# EAGLE design Rev-2 PCB (EAGLE 9.2.1)
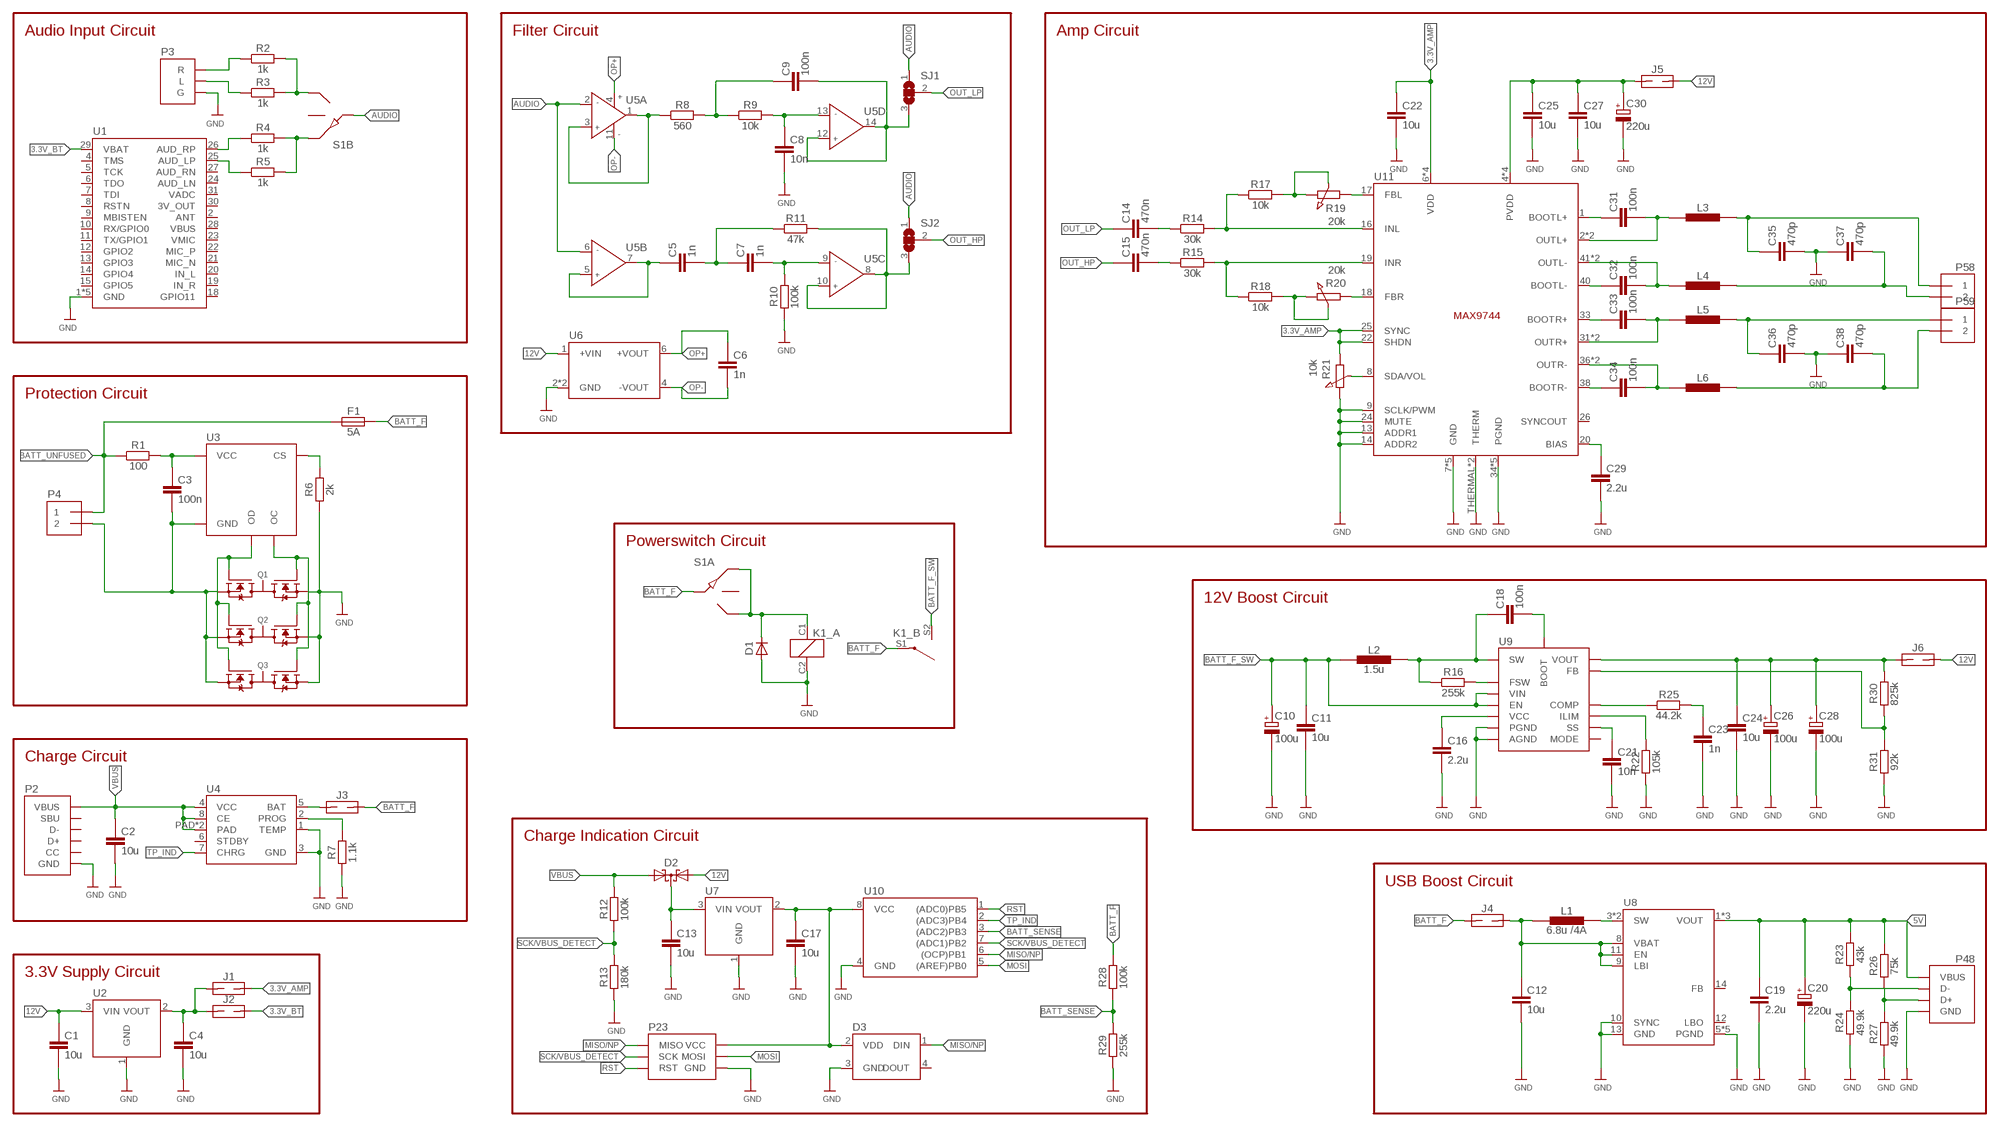
[diagram p0: schematic, sheet 1]

## Parts
C1  10u  CAPACITOR  [R0603]
C2  10u  CAPACITOR1206  [1206]
C3  100n  CAPACITOR  [R0603]
C4  10u  CAPACITOR  [R0603]
C5  1n  CAPACITOR  [R0603]
C6  1n  CAPACITOR  [R0603]
C7  1n  CAPACITOR  [R0603]
C8  10n  CAPACITOR  [R0603]
C9  100n  CAPACITOR  [R0603]
C10  100u  CAPACITOR_POL6.3X7.7MM  [UD-6,3X7,7_NICHICON]
C11  10u  CAPACITOR1206  [1206]
C12  10u  CAPACITOR1206  [1206]
C13  10u  CAPACITOR  [R0603]
C14  470n  CAPACITOR  [R0603]
C15  470n  CAPACITOR  [R0603]
C16  2.2u  CAPACITOR  [R0603]
C17  10u  CAPACITOR  [R0603]
C18  100n  CAPACITOR  [R0603]
C19  2.2u  CAPACITOR  [R0603]
C20  220u  CAPACITOR_POL6.3X7.7MM  [UD-6,3X7,7_NICHICON]
C21  10n  CAPACITOR  [R0603]
C22  10u  CAPACITOR1206  [1206]
C23  1n  CAPACITOR  [R0603]
C24  10u  CAPACITOR1206  [1206]
C25  10u  CAPACITOR1206  [1206]
C26  100u  CAPACITOR_POL6.3X7.7MM  [UD-6,3X7,7_NICHICON]
C27  10u  CAPACITOR1206  [1206]
C28  100u  CAPACITOR_POL6.3X7.7MM  [UD-6,3X7,7_NICHICON]
C29  2.2u  CAPACITOR  [R0603]
C30  220u  CAPACITOR_POL6.3X7.7MM  [UD-6,3X7,7_NICHICON]
C31  100n  CAPACITOR0805  [0805]
C32  100n  CAPACITOR0805  [0805]
C33  100n  CAPACITOR0805  [0805]
C34  100n  CAPACITOR0805  [0805]
C35  470p  CAPACITOR0805  [0805]
C36  470p  CAPACITOR0805  [0805]
C37  470p  CAPACITOR0805  [0805]
C38  470p  CAPACITOR0805  [0805]
D1  DIODEDO-214AC  [DO214AC]
D2  BAS70-05  [SOT23]
D3  NEOPIXEL  [LED-RGB-THRU]
F1  5A  FUSESMD  [FUSE_SMD]
J1  JUMPER_2S  [SJ]
J2  JUMPER_2S  [SJ]
J3  JUMPER_2S  [SJ]
J4  JUMPER_2S  [SJ]
J5  JUMPER_2S  [SJ]
J6  JUMPER_2S  [SJ]
K1  RELAY_2  [RELAY]
L1  6.8u /4A  INDUCTOR6516  [INDUCTOR234545]
L2  1.5u  INDUCTOR6519  [INDUCTOR2345]
L3  INDUCTOR0805  [0805]
L4  INDUCTOR0805  [0805]
L5  INDUCTOR0805  [0805]
L6  INDUCTOR0805  [0805]
P2  USB_TYPE-C  [TYPE-C]
P3  AUX  [AUDIO]
P4  HEADER_2MOLEX  [MOLEX_43650_2P]
P23  SPI-HEADERNS  [2X3-NS]
P48  USB_TYPE-A  [USB-A]
P58  HEADER_2MOLEX  [MOLEX_43650_2P]
P59  HEADER_2MOLEX  [MOLEX_43650_2P]
Q1  FS8205  [SOP65P640X120-8N]
Q2  FS8205  [SOP65P640X120-8N]
Q3  FS8205  [SOP65P640X120-8N]
R1  100  RESISTOR0603  [R0603]
R2  1k  RESISTOR0603  [R0603]
R3  1k  RESISTOR0603  [R0603]
R4  1k  RESISTOR0603  [R0603]
R5  1k  RESISTOR0603  [R0603]
R6  2k  RESISTOR0603  [R0603]
R7  1.1k  RESISTOR0603  [R0603]
R8  560  RESISTOR0603  [R0603]
R9  10k  RESISTOR0603  [R0603]
R10  100k  RESISTOR0603  [R0603]
R11  47k  RESISTOR0603  [R0603]
R12  100k  RESISTOR0603  [R0603]
R13  180k  RESISTOR0603  [R0603]
R14  30k  RESISTOR0603  [R0603]
R15  30k  RESISTOR0603  [R0603]
R16  255k  RESISTOR0603  [R0603]
R17  10k  RESISTOR0603  [R0603]
R18  10k  RESISTOR0603  [R0603]
R19  20k  POTLARGE  [TRIMMPOTI]
R20  20k  POTLARGE  [TRIMMPOTI]
R21  10k  POT  [POT]
R22  105k  RESISTOR0603  [R0603]
R23  43k  RESISTOR0603  [R0603]
R24  49.9k  RESISTOR0603  [R0603]
R25  44.2k  RESISTOR0603  [R0603]
R26  75k  RESISTOR0603  [R0603]
R27  49.9k  RESISTOR0603  [R0603]
R28  100k  RESISTOR0603  [R0603]
R29  255k  RESISTOR0603  [R0603]
R30  825k  RESISTOR0603  [R0603]
R31  92k  RESISTOR0603  [R0603]
S1  SWITCH  [FE06]
SJ1  SJ2W  [SJ_2]
SJ2  SJ2W  [SJ_2]
U1  BK8000  [WIRELESS-BLUETOOTH-BK8000]
U2  REG1118SOT23-3  [SOT23]
U3  FS312F  [TSOT23-6]
U4  TP4056  [SOP-8]
U5  QUAD_OP  [SO14]
U6  NMA  [CONV_PCN2-S24-D15-S]
U7  REG1118SOT23-3  [SOT23]
U8  TPS6103X  [PVQFN-16]
U9  TPS61088  [QFN50P450X350X100-21N]
U10  TINY15LS  [SOIC8]
U11  MAX9744  [TQFN44_7MM]

## Nets
3.3V_AMP: C22.1 J1.2 R21.1 U11.6(VDD) U11.10(VDD) U11.21(VDD) U11.22(SHDN) U11.25(SYNC) U11.28(VDD)
3.3V_BT: J2.2 U1.29(VBAT)
5V: C19.1 C20.+ P48.VBUS R23.2 R26.2 U8.1(VOUT) U8.15(VOUT) U8.16(VOUT)
12V: C1.1 D2.1(A1) J5.2 J6.2 U2.3(VIN) U6.1(+VIN)
12V_AMP: C25.1 C27.1 C30.+ J5.1 U11.4(PVDD) U11.5(PVDD) U11.29(PVDD) U11.30(PVDD)
AUDIO: S1.P$6(B:C) SJ1.1 SJ2.1 U5.2(A:IN-) U5.6(B:IN-)
BATT_F: F1.2 J3.2 J4.1 K1.S1(_B:MITTE) R28.2 S1.P$5(A:C)
BATT_F_SW: C10.+ C11.1 K1.S2(_B:OFF) L2.P$1 U9.2(EN) U9.9(VIN)
BATT_SENSE: R28.1 R29.2 U10.3((ADC2)PB3)
BATT_UNFUSED: F1.1 P4.1 R1.1
GND: C1.2 C2.2 C4.2 C8.2 C10.- C11.2 C12.2 C13.2 C16.2 C17.2 C19.2 C20.- C21.2 C22.2 C23.2 C24.2 C25.2 C26.- C27.2 C28.- C29.2 C30.- C35.2 C36.2 C37.1 C38.1 D1.A D3.3(GND) K1.C2 P2.A1/B12(GND) P2.B1/A12(GND) P2.P$1(GND) P2.P$2(GND) P2.P$3(GND) P2.P$4(GND) P2.P$5(GND) P2.P$6(GND) P2.P$7(GND) P2.P$8(GND) P2.P$9(GND) P2.P$10(GND) P2.P$11(GND) P2.P$12(GND) P2.P$13(GND) P2.P$14(GND) P2.P$15(GND) P2.P$16(GND) P2.P$17(GND) P2.P$18(GND) P2.P$19(GND) P2.P$20(GND) P2.P$21(GND) P2.P$22(GND) P2.P$23(GND) P2.P$24(GND) P2.P$25(GND) P2.P$26(GND) P2.P$27(GND) P2.P$28(GND) P2.P$29(GND) P2.P$30(GND) P2.P$31(GND) P2.P$32(GND) P2.P$33(GND) P2.P$34(GND) P2.P$35(GND) P2.P$36(GND) P2.P$37(GND) P2.P$38(GND) P3.P$3(G) P23.6(GND) P48.GND P48.S1(GND) P48.S2(GND) P48.S3(GND) P48.S4(GND) Q1.6(S2) Q1.7(S2) Q2.6(S2) Q2.7(S2) Q3.6(S2) Q3.7(S2) R6.1 R7.1 R10.1 R13.1 R21.3 R22.1 R24.1 R27.1 R29.1 R31.1 U1.1(GND) U1.3(GND) U1.16(GND) U1.17(GND) U1.32(GND) U2.1(GND) U4.1(TEMP) U4.3(GND) U6.2(GND) U6.5(GND) U7.1(GND) U8.5(PGND) U8.6(PGND) U8.7(PGND) U8.10(SYNC) U8.13(GND) U8.THERMAL1(PGND) U8.THERMAL(PGND) U9.20(AGND) U9.21(PGND) U9.22(PGND) U9.23(PGND) U10.4(GND) U11.7(GND) U11.9(SCLK/PWM) U11.11(GND) U11.12(GND) U11.13(ADDR1) U11.14(ADDR2) U11.15(GND) U11.24(MUTE) U11.27(GND) U11.34(PGND) U11.35(PGND) U11.39(PGND) U11.43(PGND) U11.44(PGND) U11.THERMAL1(THERM) U11.THERMAL(THERM)
MISO/NP: D3.1(DIN) P23.1(MISO) U10.6((OCP)PB1)
MOSI: P23.4(MOSI) U10.5((AREF)PB0)
N$1: C3.2 P4.2 Q1.2(S1) Q1.3(S1) Q2.2(S1) Q2.3(S1) Q3.2(S1) Q3.3(S1) U3.6(GND)
N$2: C3.1 R1.2 U3.5(VCC)
N$3: R6.2 U3.2(CS)
N$4: R8.1 U5.1(A:OUT) U5.3(A:IN+)
N$5: Q1.4(G1) Q2.4(G1) Q3.4(G1) U3.1(OD)
N$6: C13.1 D2.3(C) U7.3(VIN)
N$7: Q1.5(G2) Q2.5(G2) Q3.5(G2) U3.3(OC)
N$8: R16.2 U9.3(FSW)
N$9: C16.1 U9.1(VCC)
N$10: C18.2 U9.8(BOOT)
N$11: C18.1 L2.P$2 R16.1 U9.4(SW) U9.5(SW) U9.6(SW) U9.7(SW)
N$12: R22.2 U9.19(ILIM)
N$13: R7.2 U4.2(PROG)
N$14: C21.1 U9.10(SS)
N$15: R25.1 U9.18(COMP)
N$16: C23.1 R25.2
N$17: L1.P$2 U8.3(SW) U8.4(SW)
N$18: R30.1 R31.2 U9.17(FB)
N$19: C4.1 J1.1 J2.1 U2.2(VOUT)
N$20: C17.1 D3.2(VDD) P23.2(VCC) U7.2(VOUT) U10.8(VCC)
N$21: P48.D+ R26.1 R27.2
N$22: P48.D- R23.1 R24.2
N$23: C12.1 J4.2 L1.P$1 U8.8(VBAT) U8.9(LBI) U8.11(EN)
N$24: R21.2 U11.8(SDA/VOL)
N$25: J3.1 U4.5(BAT)
N$26: C9.1 R8.2 R9.1
N$27: C5.1 U5.5(B:IN+) U5.7(B:OUT)
N$28: R4.1 U1.26(AUD_RP)
N$29: R5.1 U1.25(AUD_LP)
N$30: C8.1 R9.2 U5.13(D:IN-)
N$31: C5.2 C7.1 R11.1
N$32: C7.2 R10.2 U5.9(C:IN-)
N$33: C24.1 C26.+ C28.+ J6.1 R30.2 U9.14(VOUT) U9.15(VOUT) U9.16(VOUT)
N$34: R18.2 R20.2 R20.3
N$35: R17.2 R19.2 R19.3
N$36: P3.P$1(L) R3.1
N$37: R19.1 U11.17(FBL)
N$38: D1.C K1.C1 S1.P$1 S1.P$3
N$39: R4.2 R5.2 S1.P$8
N$40: R2.2 R3.2 S1.P$10
N$41: P3.P$2(R) R2.1
N$42: R20.1 U11.18(FBR)
N$45: R14.2 R17.1 U11.16(INL)
N$46: R15.2 R18.1 U11.19(INR)
N$47: C29.1 U11.20(BIAS)
N$48: C31.1 U11.1(BOOTL+)
N$49: C31.2 L3.1 U11.2(OUTL+) U11.3(OUTL+)
N$50: C14.2 R14.1
N$51: C15.2 R15.1
N$52: C32.1 U11.40(BOOTL-)
N$53: C32.2 L4.1 U11.41(OUTL-) U11.42(OUTL-)
N$54: C33.1 U11.33(BOOTR+)
N$55: C33.2 L5.1 U11.31(OUTR+) U11.32(OUTR+)
N$56: C34.1 U11.38(BOOTR-)
N$57: C34.2 L6.1 U11.36(OUTR-) U11.37(OUTR-)
N$58: C35.1 L3.2 P58.1
N$59: C37.2 L4.2 P58.2
N$60: C36.1 L5.2 P59.1
N$61: C38.2 L6.2 P59.2
OP+: C6.1 U5.4(A:+) U6.6(+VOUT)
OP-: C6.2 U5.11(A:-) U6.4(-VOUT)
OUT_HP: C15.1 SJ2.2
OUT_HP_OP: R11.2 SJ2.3 U5.8(C:OUT) U5.10(C:IN+)
OUT_LP: C14.1 SJ1.2
OUT_LP_OP: C9.2 SJ1.3 U5.12(D:IN+) U5.14(D:OUT)
RST: P23.5(RST) U10.1((ADC0)PB5)
SCK/VBUS_DETECT: P23.3(SCK) R12.1 R13.2 U10.7((ADC1)PB2)
TP_IND: U4.7(CHRG) U10.2((ADC3)PB4)
VBUS: C2.1 D2.2(A2) P2.A4/B9(VBUS) P2.B4/A9(VBUS) R12.2 U4.4(VCC) U4.8(CE) U4.PAD U4.PAD2(PAD)
Unconnected: D3.4(DOUT) P2.A5(CC) P2.A6(D+) P2.A7(D-) P2.A8(SBU) P2.B5(CC) P2.B6(D+) P2.B7(D-) P2.B8(SBU) Q1.1(D12) Q1.8(D12) Q2.1(D12) Q2.8(D12) Q3.1(D12) Q3.8(D12) S1.P$2 S1.P$9 U1.2(ANT) U1.4(TMS) U1.5(TCK) U1.6(TDO) U1.7(TDI) U1.8(RSTN) U1.9(MBISTEN) U1.10(RX/GPIO0) U1.11(TX/GPIO1) U1.12(GPIO2) U1.13(GPIO3) U1.14(GPIO4) U1.15(GPIO5) U1.18(GPIO11) U1.19(IN_R) U1.20(IN_L) U1.21(MIC_N) U1.22(MIC_P) U1.23(VMIC) U1.24(AUD_LN) U1.27(AUD_RN) U1.28(VBUS) U4.6(STDBY) U8.12(LBO) U8.14(FB) U9.13(MODE) U11.26(SYNCOUT)

## Notes on the sheet
- Audio Input Circuit | Filter Circuit | Amp Circuit
- Protection Circuit
- Powerswitch Circuit
- 12V Boost Circuit
- Charge Circuit
- Charge Indication Circuit
- USB Boost Circuit
- 3.3V Supply Circuit

## Power pins joined to a net without a drawn wire
3V_OUT: U1.30(3V_OUT)
VADC: U1.31(VADC)

## Library data of the parts
C1 C4-C9 C13 C17 C22 C25 C27 C29 C31-C38 = 0_Library-Rev2:CAPACITOR; SPICEPREFIX: C
C2 C3 C11 C12 C14-C16 C18 C19 C21 C23 C24 = 0_Library-Rev2:CAPACITOR
C10 C20 C26 C28 C30 = 0_Library-Rev2:CAPACITOR_POL
D1 = 0_Library-Rev2:DIODE: DIODE General purpose 1N400x type rectifier (With bigger pads) http://www.ladyada.net/library/pcb/eaglelibrary.html
D2 = 0_Library-Rev2:BAS70-05: Silicon Schottky Diodes General-purpose diode for high-speed switching
D3 = 0_Library-Rev2:NEOPIXEL
F1 = 0_Library-Rev2:FUSE
J1-J6 = 0_Library-Rev2:JUMPER_2
K1 = 0_Library-Rev2:RELAY_2
L1-L6 = 0_Library-Rev2:INDUCTOR
P2 = 0_Library-Rev2:USB_TYPE-C
P3 = 0_Library-Rev2:AUX; SPICEPREFIX: J
P4 P58 P59 = 0_Library-Rev2:HEADER_2
P23 = 0_Library-Rev2:SPI-HEADER: AVR ISP 6 Pin This is the reduced ISP connector for AVR programming. Common on Arduino. This footprint will take up less PCB space and can be used with a 10-pin to 6-pin adapter such as SKU: BOB-08508 **Special note about "TEST_POINT" package. The stop mask is on the top side, so if you want your programming test points to be on the bottom of your board, make sure to place this package on the bottom side of the board. This also ensure that the orientation to program from the bottom side will be correct. SparkFun Products: SparkFun ISP Pogo Adapter <https://www.sparkfun.com/products/11591> - NS Tiny AVR Programmer <https://www.sparkfun.com/products/11801> -PTH; SPICEPREFIX: X
P48 = 0_Library-Rev2:USB_TYPE-A
Q1-Q3 = 0_Library-Rev2:FS8205
R1 R6 R7 R12-R18 R22-R31 = 0_Library-Rev2:RESISTOR
R2-R5 R8-R11 = 0_Library-Rev2:RESISTOR; SPICEPREFIX: R
R19-R21 = 0_Library-Rev2:POT
S1 = 0_Library-Rev2:SWITCH; SPICEPREFIX: S
SJ1 SJ2 = jumper:SJ2W: SMD solder JUMPER
U1 = 0_Library-Rev2:BK8000; SPICEPREFIX: X
U2 = 0_Library-Rev2:REG1118: 800mA Low Dropout (LDO) Positive Regulator with Current Source and Sink Capability; SPICEPREFIX: U
U3 = 0_Library-Rev2:FS312F
U4 = 0_Library-Rev2:TP4056
U5 = 0_Library-Rev2:QUAD_OP; SPICEPREFIX: X
U6 = 0_Library-Rev2:NMA; SPICEPREFIX: E
U7 = 0_Library-Rev2:REG1118: 800mA Low Dropout (LDO) Positive Regulator with Current Source and Sink Capability
U8 = 0_Library-Rev2:TPS6103X: TPS6103x 4A Boost - 1.8-5.5V Input, Adjustable Output to 5.5V
U9 = 0_Library-Rev2:TPS61088
U10 = 0_Library-Rev2:TINY15L: MICROCONTROLLER 2.7 V 1 Kbytes FLASH 64 bytes EEPROM 4-channel 10 bit ADC; OC_FARNELL: unknown; OC_NEWARK: unknown
U11 = 0_Library-Rev2:MAX9744

## Board
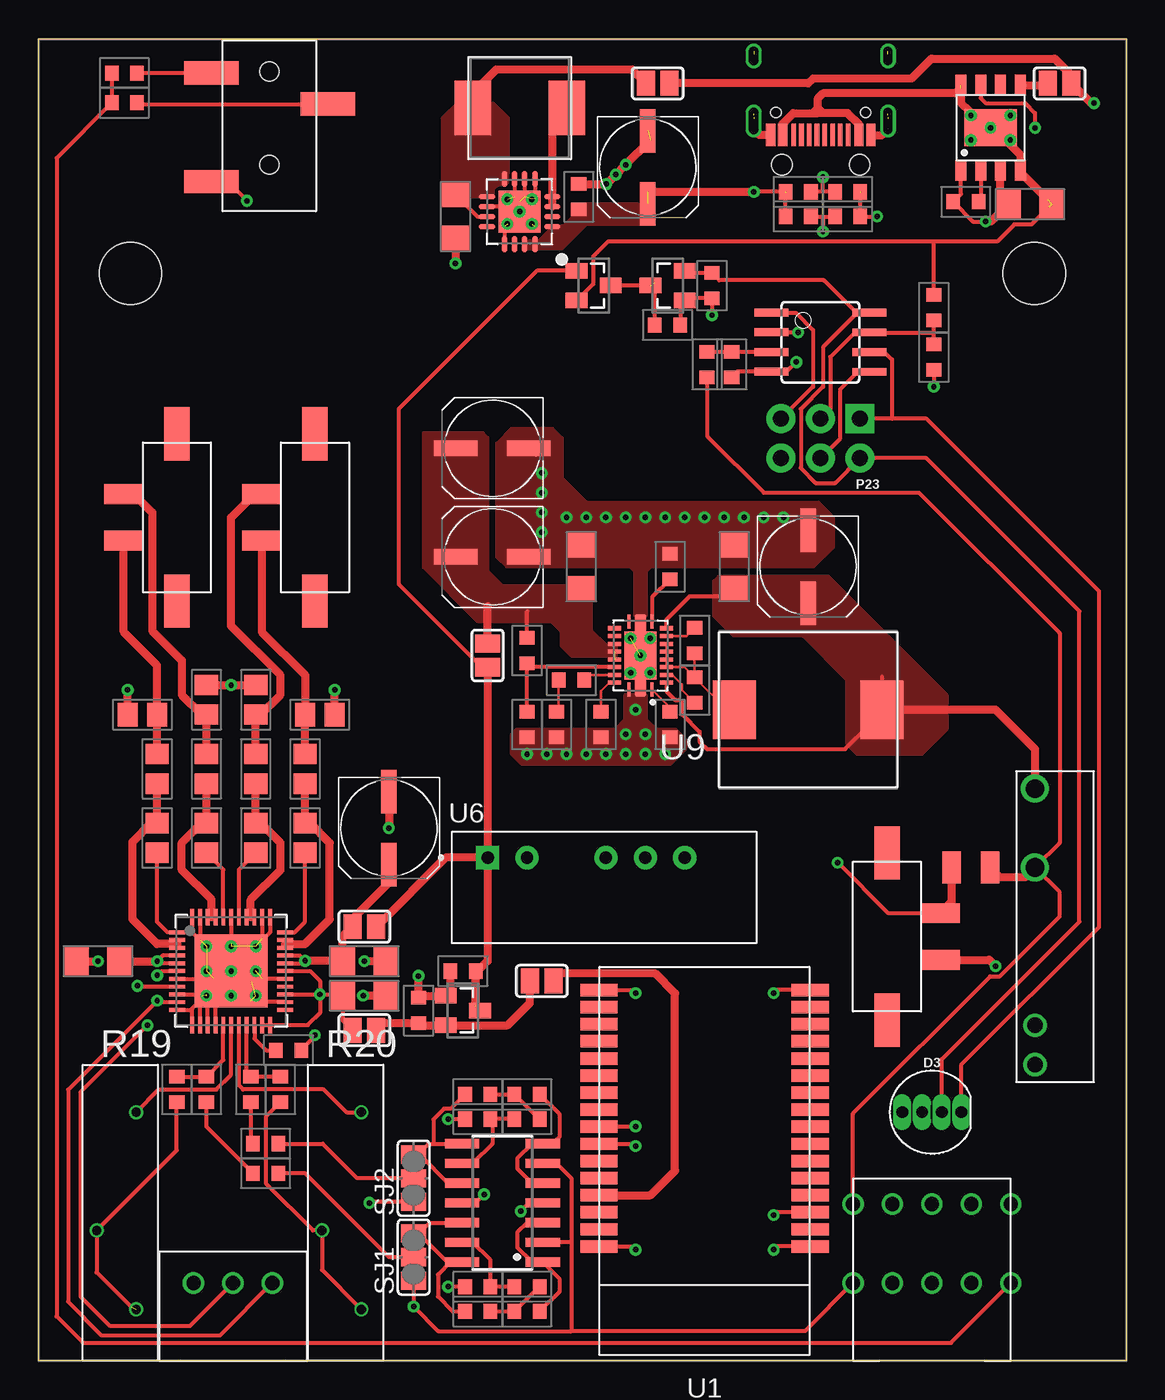
[diagram p1: board, top side]
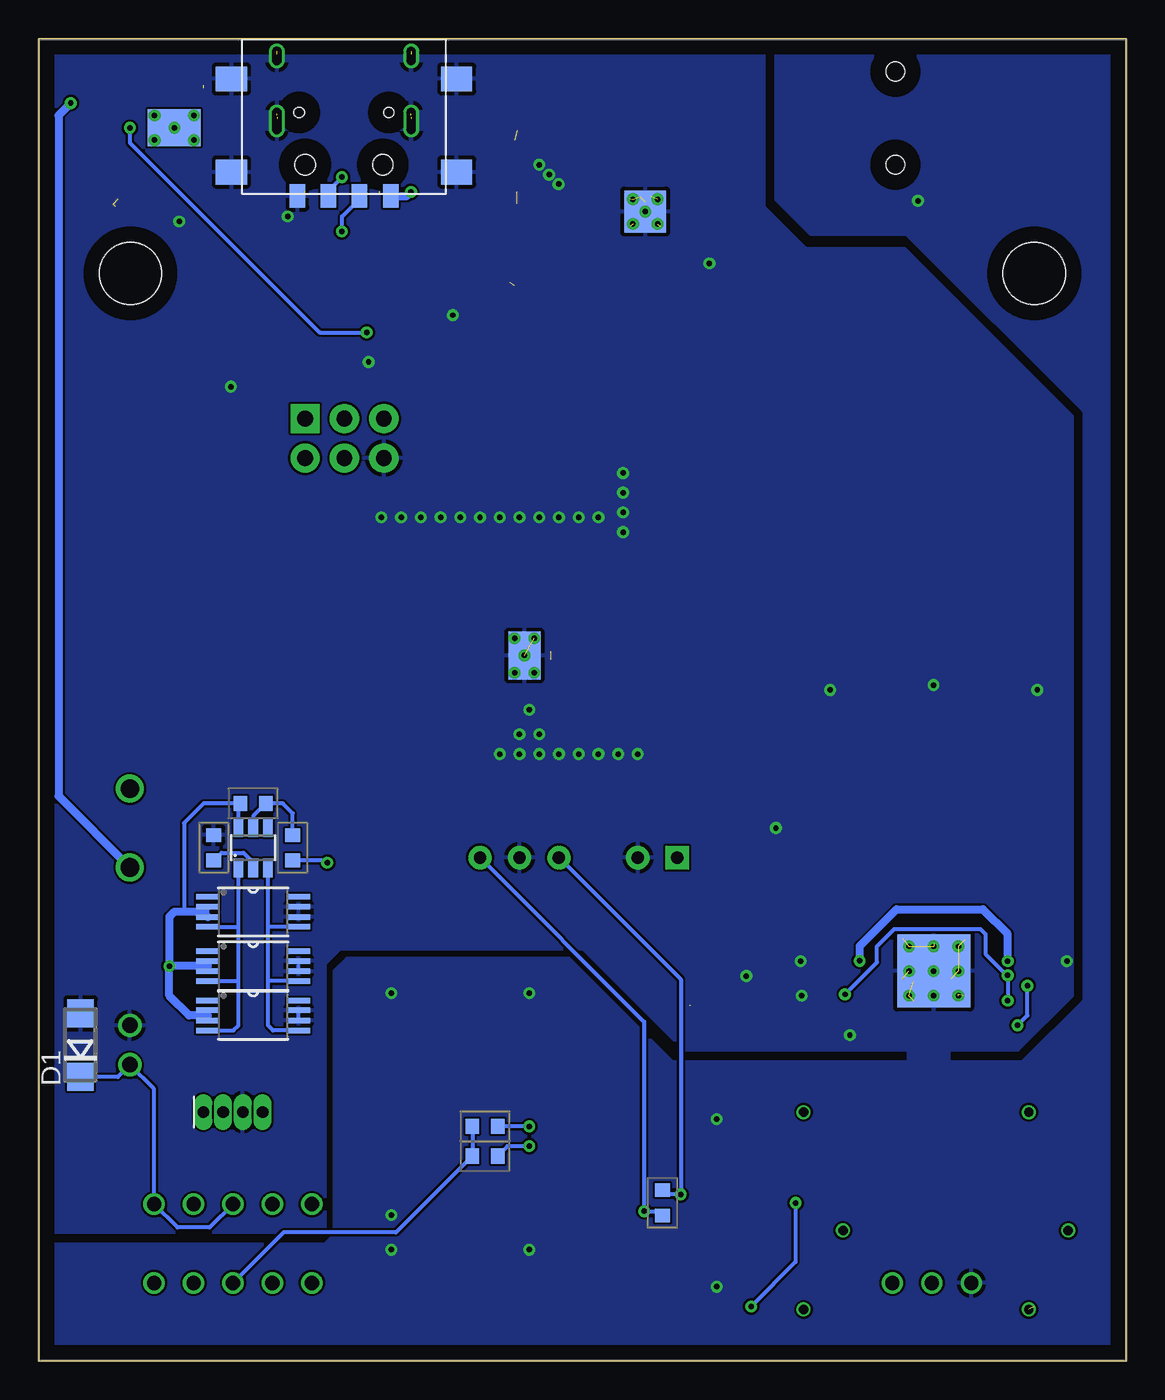
[diagram p2: board, bottom side, seen from below]

Size 70 x 85.1 mm. Coordinates in mm from the lower left corner, seen from the top.
Outline: 0,0 0,85.1 70,85.1 70,0 0,0
Copper layers (1*16): Top 0.035mm / dielectric 1.5mm / Bottom 0.035mm
Design rules "default *": minimum track width 6mil, minimum drill 0.35mm, track to track 6mil, track to pad 6mil, pad to pad 6mil, via to via 6mil, smd to smd 6mil, copper to edge 40mil, drill to drill 6mil, minimum pad ring 0mil, minimum via ring 8mil, stop-mask expansion 4mil, vias tented up to drill 0mil, thermal gap 10mil
Holes 4 mm at 5.9,70 64.1,70

### Footprints (pad centres in the part's own frame; a part is rotated, then mirrored left to right if it is on the bottom)
R0603 = smd 0.87 x 0.98: 1 -0.815,0; 2 0.815,0
1206 = smd 1.6 x 1.8: 1 -1.4,0; 2 1.4,0
UD-6,3X7,7_NICHICON = smd 2.8 x 1: + 2.35,0; - -2.35,0
0805 = smd 1.3 x 1.5: 1 -0.95,0; 2 0.95,0
DO214AC = smd 1.8 x 1.7: A 2.05,0; C -2.05,0
SOT23 = smd 1 x 1.4: 1 -0.95,-1.1; 2 0.95,-1.1; 3 0,1.1
LED-RGB-THRU = drill 0.762 pad 0.889 long: 1 1.905,0; 2 0.635,0; 3 -0.635,0; 4 -1.905,0
FUSE_SMD = smd 1.185 x 2.05: 1 -1.232,0; 2 1.232,0
SJ = smd 1.168 x 1.6: 1 -0.762,0; 2 0.762,0
RELAY = drill 1: C1 0,0; C2 2.54,0 | drill 1.2: S1 12.7,0; S2 17.78,0
INDUCTOR234545 = smd 2.35 x 3.5: P$1 -3.025,0; P$2 3.025,0
INDUCTOR2345 = smd 2.75 x 3.75: P$1 -4.75,0; P$2 4.75,0
TYPE-C = smd 0.6 x 1.45: A1/B12 -3.225,7.695; A4/B9 -2.45,7.695; B1/A12 3.225,7.695; B4/A9 2.45,7.695 | smd 0.3 x 1.45: A5 -1.25,7.695; A6 -0.25,7.695; A7 0.25,7.695; A8 1.25,7.695; B5 1.75,7.695; B6 0.75,7.695; B7 -0.75,7.695; B8 -1.75,7.695 | drill 0.6 pad 1: P$1 -4.32,6.23; P$2 -4.32,6.53; P$3 -4.32,6.63; P$4 -4.32,6.73; P$5 -4.32,6.33; P$6 -4.32,7.23; P$7 4.32,6.83; P$8 4.32,6.23; P$9 4.32,6.53; P$10 4.32,6.63; P$11 -4.32,7.13; P$12 -4.32,6.43; P$13 -4.32,6.83; P$14 4.32,6.73; P$15 4.32,6.33; P$16 4.32,7.23; P$17 4.32,6.43; P$18 4.32,7.13; P$19 4.32,7.33; P$20 4.32,2.9; P$21 4.32,2.3; P$22 4.32,2.6; P$23 4.32,2.7; P$24 4.32,2.8; P$25 4.32,2.4; P$26 4.32,2.5; P$27 -4.32,2.9; P$28 -4.32,2.3; P$29 -4.32,2.6; P$30 -4.32,2.7; P$31 -4.32,2.8; P$32 -4.32,2.4; P$33 -4.32,2.5; P$34 4.32,7.03; P$35 4.32,6.93; P$36 -4.32,7.33; P$37 -4.32,7.03; P$38 -4.32,6.93 | hole 0.65: -2.89,6.25; 2.89,6.25
AUDIO = smd 1.5 x 3.5: P$1 5.1,-3.75; P$2 7.1,3.75; P$3 12.1,-3.75 | hole 1.2: 5,0; 11,0
MOLEX_43650_2P = smd 1.27 x 2.54: 1 -1.5,3.42; 2 1.5,3.42 | smd 3.43 x 1.65: P$2 -5.385,0; P$5 5.385,0
2X3-NS = drill 1.016 pad 1.88 square: 1 -2.54,-1.27 | drill 1.016 pad 1.88: 2 -2.54,1.27; 3 0,-1.27; 4 0,1.27; 5 2.54,-1.27; 6 2.54,1.27
USB-A = smd 1 x 1.5: D+ 1,10.12; D- -1,10.12; GND 3,10.12; VBUS -3,10.12 | smd 2 x 1.6: S1 -7.25,8.58; S2 -7.25,2.58; S3 7.25,8.58; S4 7.25,2.58 | hole 1.3: -2.5,8.1; 2.5,8.1
SOP65P640X120-8N = smd 1.473 x 0.356: 1 -2.921,0.965; 2 -2.921,0.33; 3 -2.921,-0.33; 4 -2.921,-0.965; 5 2.921,-0.965; 6 2.921,-0.33; 7 2.921,0.33; 8 2.921,0.965
TRIMMPOTI = drill 0.6: 1 -16,1.015; 2 -8.38,-1.525; 3 -3.3,1.015
POT = drill 0.914: 1 -2.54,0; 2 0,0; 3 2.54,0
FE06 = drill 0.914: P$1 -5.08,-5.08; P$2 -2.54,-5.08; P$3 0,-5.08; P$4 2.54,-5.08; P$5 5.08,-5.08; P$6 5.08,0; P$7 2.54,0; P$8 0,0; P$9 -2.54,0; P$10 -5.08,0
SJ_2 = smd 1.168 x 1.6: 1 -1.524,0; 2 0,0; 3 1.524,0
WIRELESS-BLUETOOTH-BK8000 = smd 2.4 x 0.8: 1 -6.8,5.5; 2 -6.8,4.4; 3 -6.8,3.3; 4 -6.8,2.2; 5 -6.8,1.1; 6 -6.8,0; 7 -6.8,-1.1; 8 -6.8,-2.2; 9 -6.8,-3.3; 10 -6.8,-4.4; 11 -6.8,-5.5; 12 -6.8,-6.6; 13 -6.8,-7.7; 14 -6.8,-8.8; 15 -6.8,-9.9; 16 -6.8,-11; 17 6.8,-11; 18 6.8,-9.9; 19 6.8,-8.8; 20 6.8,-7.7; 21 6.8,-6.6; 22 6.8,-5.5; 23 6.8,-4.4; 24 6.8,-3.3; 25 6.8,-2.2; 26 6.8,-1.1; 27 6.8,0; 28 6.8,1.1; 29 6.8,2.2; 30 6.8,3.3; 31 6.8,4.4; 32 6.8,5.5
TSOT23-6 = smd 0.62 x 1.22: 1 -0.95,-1.3; 2 0,-1.3; 3 0.95,-1.3; 4 0.95,1.3; 5 0,1.3; 6 -0.95,1.3
SOP-8 = smd 1.3 x 0.7: 1 -2.75,1.905; 2 -2.75,0.635; 3 -2.75,-0.635; 4 -2.75,-1.905; 5 2.75,-1.905; 6 2.75,-0.635; 7 2.75,0.635; 8 2.75,1.905 | smd 2.4 x 3.4: PAD 0,0 | smd 2.4 x 3.4 bottom: PAD2 0,0
SO14 = smd 0.6 x 2.2: 1 -3.81,-2.6; 2 -2.54,-2.6; 3 -1.27,-2.6; 4 0,-2.6; 5 1.27,-2.6; 6 2.54,-2.6; 7 3.81,-2.6; 8 3.81,2.6; 9 2.54,2.6; 10 1.27,2.6; 11 0,2.6; 12 -1.27,2.6; 13 -2.54,2.6; 14 -3.81,2.6
CONV_PCN2-S24-D15-S = drill 0.8 pad 1.5 square: 1 0,0 | drill 0.8 pad 1.5: 2 2.54,0; 4 7.62,0; 5 10.16,0; 6 12.7,0
PVQFN-16 = smd 1.05 x 0.35: 1 -2.1,0.975; 2 -2.1,0.325; 3 -2.1,-0.325; 4 -2.1,-0.975; 9 2.1,-0.975; 10 2.1,-0.325; 11 2.1,0.325; 12 2.1,0.975 | smd 0.35 x 1.05: 5 -0.975,-2.1; 6 -0.325,-2.1; 7 0.325,-2.1; 8 0.975,-2.1; 13 0.975,2.1; 14 0.325,2.1; 15 -0.325,2.1; 16 -0.975,2.1 | smd 2.7 x 2.7: THERMAL 0,0 | smd 2.7 x 2.7 bottom: THERMAL1 0,0
QFN50P450X350X100-21N = smd 0.26 x 0.9: 1 -0.75,2.185; 10 -0.75,-2.185; 11 0.75,-2.185; 20 0.75,2.185 | smd 0.9 x 0.26: 2 -1.685,1.75; 3 -1.685,1.25; 4 -1.685,0.75; 5 -1.685,0.25; 6 -1.685,-0.25; 7 -1.685,-0.75; 8 -1.685,-1.25; 9 -1.685,-1.75; 12 1.685,-1.75; 13 1.685,-1.25; 14 1.685,-0.75; 15 1.685,-0.25; 16 1.685,0.25; 17 1.685,0.75; 18 1.685,1.25; 19 1.685,1.75 | smd 2.07 x 3.07: 21 0,0 | smd 0.75 x 5.27: 22 0,0 | smd 2.07 x 3.07 bottom: 23 0,0
SOIC8 = smd 0.5 x 2.2: 1 -1.905,-3.154; 2 -0.645,-3.154; 3 0.625,-3.154; 4 1.895,-3.154; 5 1.905,3.154; 6 0.635,3.154; 7 -0.635,3.154; 8 -1.905,3.154
TQFN44_7MM = smd 0.25 x 1.05: 1 -2.5,-3.475; 2 -2,-3.475; 3 -1.5,-3.475; 4 -1,-3.475; 5 -0.5,-3.475; 6 0,-3.475; 7 0.5,-3.475; 8 1,-3.475; 9 1.5,-3.475; 10 2,-3.475; 11 2.5,-3.475; 23 2.5,3.475; 24 2,3.475; 25 1.5,3.475; 26 1,3.475; 27 0.5,3.475; 28 0,3.475; 29 -0.5,3.475; 30 -1,3.475; 31 -1.5,3.475; 32 -2,3.475; 33 -2.5,3.475 | smd 1.05 x 0.25: 12 3.475,-2.5; 13 3.475,-2; 14 3.475,-1.5; 15 3.475,-1; 16 3.475,-0.5; 17 3.475,0; 18 3.475,0.5; 19 3.475,1; 20 3.475,1.5; 21 3.475,2; 22 3.475,2.5; 34 -3.475,2.5; 35 -3.475,2; 36 -3.475,1.5; 37 -3.475,1; 38 -3.475,0.5; 39 -3.475,0; 40 -3.475,-0.5; 41 -3.475,-1; 42 -3.475,-1.5; 43 -3.475,-2; 44 -3.475,-2.5 | smd 4.7 x 4.7: THERMAL 0,0 | smd 4.7 x 4.7 bottom: THERMAL1 0,0

### Placement (x,y rotation side)
C1  27.3,25.08 180 top
C2  63.82,74.45 180 top
C3  56.2,35.88 180 bottom
C4  24.45,22.54 90 top
C5  31.43,17.14 180 top
C6  29.84,10.16 90 bottom
C7  31.43,15.56 180 top
C8  28.26,4.76 180 top
C9  28.26,3.17 180 top
C10  49.53,51.12 270 top
C11  44.77,51.12 90 top
C12  26.83,73.66 270 top
C13  40.48,66.67 0 top
C14  14.61,12.06 180 top
C15  14.61,13.97 180 top
C16  40.64,40.96 270 top
C17  43.34,69.22 270 top
C18  42.23,46.35 90 top
C19  34.77,74.93 90 top
C20  39.21,76.83 270 top
C21  40.64,51.12 90 top
C22  20.95,23.5 0 top
C23  33.34,40.96 270 top
C24  34.92,51.12 90 top
C25  20.95,25.72 0 top
C26  29.21,51.75 180 top
C27  3.81,25.72 180 top
C28  29.21,58.74 180 top
C29  16.08,19.98 0 top
C30  22.54,34.29 270 top
C31  7.62,33.66 90 top
C32  10.79,33.66 90 top
C33  17.14,33.66 90 top
C34  13.97,33.66 90 top
C35  6.67,41.59 180 top
C36  18.1,41.59 0 top
C37  10.79,42.55 270 top
C38  13.97,42.55 270 top
D1  67.31,20.32 90 bottom
D2  35.72,69.22 270 top
D3  57.5,16 0 top
F1  60.01,31.75 0 top
J1  20.95,21.27 180 top
J2  32.38,24.45 0 top
J3  65.72,82.23 0 top
J4  39.85,82.23 180 top
J5  20.95,27.94 0 top
J6  28.89,45.4 270 top
K1  64.14,19.05 90 top
L1  30.96,80.64 0 top
L2  49.53,41.91 180 top
L3  7.62,38.1 90 top
L4  10.79,38.1 90 top
L5  17.14,38.1 90 top
L6  13.97,38.1 90 top
P2  50.35,86.6 180 top
P3  14.85,88 270 top
P4  54.61,27.3 270 top
P23  50.32,59.37 180 top
P48  50.35,85.1 180 bottom
P58  8.89,54.29 90 top
P59  17.78,54.29 90 top
Q1  56.2,28.89 0 bottom
Q2  56.2,25.4 0 bottom
Q3  56.2,22.23 0 bottom
R1  53.66,33.02 90 bottom
R2  5.51,80.98 180 top
R3  5.51,82.89 180 top
R4  41.27,13.18 180 bottom
R5  41.27,15.08 180 bottom
R6  58.74,33.02 270 bottom
R7  59.69,74.61 0 top
R8  31.43,3.17 180 top
R9  31.43,4.76 180 top
R10  28.26,15.56 0 top
R11  28.26,17.14 180 top
R12  57.63,67.79 90 top
R13  57.63,64.61 90 top
R14  10.79,17.46 90 top
R15  13.65,17.46 90 top
R16  42.23,43.18 270 top
R17  8.89,17.46 270 top
R18  15.56,17.46 270 top
R19  5.25,0 270 top
R20  19.75,0 270 top
R21  12.5,5 180 top
R22  36.2,40.96 90 top
R23  48.9,73.66 180 top
R24  52.07,73.66 180 top
R25  34.29,43.81 180 top
R26  48.9,75.25 180 top
R27  52.07,75.25 180 top
R28  43.02,64.14 270 top
R29  44.61,64.14 90 top
R30  31.43,45.72 90 top
R31  31.43,40.96 90 top
S1  57.5,5 180 top
SJ1  24.13,6.67 90 top
SJ2  24.13,11.75 90 top
U1  42.86,12.86 180 top
U2  27.3,22.54 270 top
U3  56.2,33.02 0 bottom
U4  61.28,79.38 90 top
U5  29.84,10.16 90 top
U6  28.89,32.38 0 top
U7  40.48,69.22 90 top
U8  30.96,73.98 180 top
U9  38.73,45.4 180 top
U10  50.32,65.56 270 top
U11  12.38,25.08 270 top

### Tracks (layer width: path | path; a pad name or v marks a point on that pad's centre or on a via)
3.3V_AMP  (via drill 0.35)
  Top 0.254: U11.25 v18.1,23.58 | v18.1,23.58 19.47,23.58 | 19.47,23.58 C22.1 19.55,21.91 J1.2 | 19.47,23.71 19.47,23.58 | v7.62,24.81 7.87,25.06 7.89,25.06 7.92,25.08 U11.6 | U11.10 7.71,23.08 v7.62,23.18 1.88,17.44 1.88,3.79 4.06,1.62 11.65,1.62 R21.1 | U11.21 U11.22 17.32,21.61 18.1,22.38 v18.1,23.58 | U11.28 17.46,25.08 18.1,24.45 v18.1,23.58
  Bottom 0.254: v7.62,23.18 v7.62,24.81 7.66,24.81 9.05,26.19 9.05,27.46 9.37,27.78 14.92,27.78 16.03,26.67 16.03,25.65 v18.1,23.58
3.3V_BT
  Top 0.508: U1.29 39.39,10.66 40.96,12.22 40.96,23.65 39.69,24.92 33.62,24.92 J2.2
5V  (via drill 0.35)  (2 unrouted)
  Top 0.254: R23.2 48.08,75.21 | R26.2 v46.04,75.25
  Top 0.508: 39.21,75.25 v46.04,75.25
  Bottom 0.508: P48.VBUS 46.3,74.98 v46.04,75.25
  pour Top (no thermals): 31.27,72.07 32.07,72.07 32.23,72.07 32.86,72.71 33.02,72.87 33.02,73.03 33.81,73.03 35.24,74.45 39.21,74.45 39.37,74.3 39.37,73.34 39.21,73.18 35.88,73.18 35.24,73.18 33.66,71.6 31.27,71.6 31.27,71.91
12V  (1 unrouted)
  Top 0.254: J6.2 28.54,44.64 23.18,50.01 23.18,61.28 32.06,70.17 D2.1 34.77,70.17
  Top 0.508: C1.1 28.12,22.83 | U6.1 26.19,32.38 21.75,27.94 J5.2 | U6.1 28.89,25.73 28.09,24.92 28.09,22.86 U2.3 | J6.2 U6.1
12V_AMP  (via drill 0.35)
  Top 0.254: U11.4 7.99,26.08 v7.62,25.72 7.75,25.58 U11.5 | U11.30 16.8,26.08 v17.14,25.74 16.99,25.58 U11.29
  Top 0.508: C27.1 v7.62,25.72 | v17.14,25.74 19.27,25.74 19.25,25.72 C25.1 19.53,25.71 19.53,27.28 J5.1 20.19,28.45 22.54,30.8 C30.+
  Bottom 0.508: v7.62,25.72 7.62,27.46 9.21,29.05 14.79,29.05 17.14,26.69 v17.14,25.74
AUDIO  (via drill 0.35)
  Top 0.254: U5.6 33.34,12.7 34.29,11.75 34.29,7.62 | 34.29,7.62 U5.2 | S1.P$6 49.33,1.91 34.29,1.91 | 34.29,7.62 34.29,1.91 | SJ1.1 v24.13,3.49 25.72,1.91 34.29,1.91 | SJ2.1 21.34,10.22 v21.27,10.16
  Bottom 0.254: v21.27,10.16 21.27,6.35 v24.13,3.49
BATT_F  (via drill 0.35)
  Top 0.254: S1.P$5 52.42,15.91 61.26,24.74 61.87,24.74 65.72,28.6 65.72,30.16 K1.S1 65.72,33.34 65.72,46.83 56.67,55.88 46.67,55.88 43.02,59.53 R28.2
  Top 0.508: J4.1 49.53,82.23 49.86,82.56 56.21,82.56 57.48,83.83 65.41,83.83 66.48,82.75 J3.2 67.75,80.96 v67.94,80.96 | F1.2 61.88,31.11 63.5,31.11 K1.S1
  Bottom 0.508: v67.94,80.96 68.73,80.18 68.73,36.34 K1.S1
BATT_F_SW
  Top 0.254: 54.28,44.02 L2.P$1 53.34,40.97 53.34,40.8 51.91,39.37 43.02,39.37 42.55,39.85 42.55,40.48 41.43,41.59 41.43,42.39 41.27,42.55 40.96,42.55 40.42,43.08 U9.2 | U9.9 40.42,47.72 41.91,49.21 44.45,49.21
  Top 0.508: L2.P$1 61.59,41.91 64.14,39.37 K1.S2
  pour Top (no thermals): 43.81,50.48 50.8,50.48 58.42,42.86 58.42,40.64 56.83,39.05 52.7,39.05 52.07,39.69 52.07,43.81 49.21,46.67 44.77,46.67 43.5,47.94 43.5,50.16
BATT_SENSE
  Top 0.254: R28.1 R29.2 44.62,64.94 U10.3
BATT_UNFUSED  (via drill 0.35)
  Top 0.254: P4.1 54.7,28.8 v51.44,32.07
  Top 0.508: P4.1 58.77,29.55 F1.1
  Bottom 0.254: 53.98,31.89 R1.1 51.57,32.2 v51.44,32.07
GND  (via drill 0.35)  (27 unrouted)
  Top 0.152: 31.99,51.94 C26.-
  Top 0.254: v26.35,15.56 R10.1 | 36.17,23.97 U1.17 38.21,23.86 v38.42,23.65 | 31.99,58.31 C28.- | P3.P$3 12.18,75.9 v13.4,74.68 | 52.88,75.21 R24.1 v53.98,73.66 | U8.6 31.28,74.94 | 30.96,74.3 30.96,74.62 30.63,74.95 U8.7 | 30.96,74.3 30.96,74 30,73.03 29.98,73.02 U8.13 | U8.5 31.93,74.81 | U8.10 30.96,74.3 | U4.1 59.37,75.11 R7.1 60.15,73.34 v60.96,73.34 | C8.2 v26.35,4.76 | U1.32 38.2,7.36 v38.42,7.14 | U1.16 47.51,23.86 v47.31,23.65 | U1.1 47.52,7.36 v47.31,7.14 | U1.3 47.5,9.56 v47.31,9.37 | C29.2 16.91,20 v17.78,20.95 | U11.24 13.75,23.08 13.65,23.18 | U11.15 11.38,23.23 11.11,23.5 | U11.14 10.88,23.27 11.11,23.5 | 11.2,23.58 11.11,23.5 | U11.13 10.38,23.4 10.48,23.5 | U11.9 10.79,23.58 | 10.79,23.58 11.2,23.58 | 11.2,23.58 12.38,24.77 U11.THERMAL1 12.29,25.08 10.79,23.58 | U11.11 9.79,22.58 9.88,22.67 | 9.88,22.67 10.79,23.58 | U11.12 9.88,22.67 | R13.1 v57.63,62.71 | C13.2 41.3,67.98 U7.1 41.72,68.4 C17.2 v43.34,67.31 | R29.1 44.96,63.67 U10.4 48.14,63.67 v48.77,64.29 | U11.7 10.37,24.58 10.52,24.43 11.07,24.43 11.26,24.62 | 13.43,24.7 13.7,24.43 14.24,24.43 14.4,24.58 U11.27 | U11.39 12.38,26.85 | U11.43 10.38,27.24 | 10.38,27.24 10.38,27.08 9.88,27.58 U11.44 | 10.41,27.21 10.38,27.24 | U11.35 14.38,27.19 14.44,27.14 14.88,27.58 U11.34
  Top 0.508: P2.A1/B12 54.3,78.91 P2.P$36 | P2.B1/A12 46.4,78.91 P2.P$19 | C19.2 v36.53,75.75 v37.15,76.36 v37.78,76.99 39.37,78.58 | U8.THERMAL1 30.96,74 | U8.THERMAL1 30.01,73.03 30,73.03 | U8.THERMAL1 31.91,73.03 | U8.THERMAL1 30.96,73.7 | C12.2 v26.83,70.64 | U4.3 61.91,74.61 C2.2 61.31,73.34 v60.96,73.34 | C1.2 26.49,23.78 U2.1 24.58,23.49 C4.2 v24.45,24.77 | C27.2 v3.81,25.72 | C25.2 v20.95,25.72 | C22.2 v20.89,23.5 | C30.- v22.54,34.29 | C35.2 v5.72,43.18 v5.71,43.18 | C37.1 v12.38,43.49 C38.1 | C36.2 v19.05,43.18
  Bottom 0.254: Q3.6 Q3.7 | Q2.6 53.28,25.4 | v36.53,75.75 36.51,75.72 36.35,75.72 | v48.77,64.29 48.58,64.29
  Bottom 0.508: 58.67,33.9 R6.1 | v12.38,43.49 v12.38,43.5
  other vias: 31.43,39.05 32.7,39.05 36.51,39.05 33.97,39.05 35.24,39.05 37.78,39.05 39.05,39.05 40.32,39.05 39.05,40.32 38.42,41.91 37.78,40.32 32.38,57.15 32.38,53.34 33.97,54.29 32.38,55.88 32.38,54.61 35.24,54.29 36.51,54.29 37.78,54.29 39.05,54.29 40.32,54.29 44.13,54.29 41.59,54.29 42.86,54.29 45.4,54.29 46.67,54.29 47.94,54.29 13.97,25.08 13.97,26.67 12.38,26.67 12.38,25.08 10.79,26.67 10.79,25.08 10.79,23.5 12.38,23.5 13.97,23.5 30.16,74.77 31.75,74.77 30.96,73.98 31.75,73.18 30.16,73.18
  pour Top (no thermals): 39.05,47.94 38.42,47.94 38.42,50.8 38.1,51.12 30.16,51.12 29.53,51.75 29.53,59.05 30.48,60.01 33.02,60.01 33.66,59.37 33.66,56.83 35.24,55.24 50.16,55.24 51.12,54.29 51.12,52.39 49.85,51.12 39.37,51.12 39.05,50.8
  pour Top (no thermals): 30.8,40.64 37.15,40.64 37.78,41.27 37.78,42.86 39.05,42.86 39.05,41.27 39.69,40.64 40.96,40.64 41.59,40.01 41.59,39.37 40.64,38.42 31.11,38.42 30.48,39.05 30.48,40.32
  pour Bottom: 73.98,6.67 73.98,-4.13 73.82,-4.29 -5.87,-4.29 -6.83,-5.24 -6.83,84.77 -0.48,91.12 19.21,91.12 22.54,87.79 22.54,74.77 20.32,72.55 14.13,72.55 2.7,61.12 2.7,23.18 6.67,19.21 29.21,19.21 35.88,25.88 50.16,25.88 50.96,25.08 50.96,8.1 51.59,7.46 73.18,7.46
  pour Bottom: 23.34,87 23.34,74.3 20.64,71.6 14.29,71.6 3.49,60.8 3.49,23.5 6.99,20 11.43,20 11.43,19.05 13.97,19.05 13.97,20 28.42,20 34.92,26.51 50.64,26.51 51.59,25.56 51.59,8.26 71.44,8.26 71.44,93.82 74.77,97.16 33.5,97.16
GND3  (via drill 0.35)  (1 unrouted)
  other vias: 38.73,45.4 38.1,46.51
GND4  (via drill 0.35)
  other vias: 39.37,44.29
GND5  (via drill 0.35)
  other vias: 39.37,46.51
GND6  (via drill 0.35)
  other vias: 38.1,44.29
MISO/NP
  Top 0.254: D3.1 59.41,19.08 68.26,27.94 68.26,49.53 57.15,60.64 54.93,60.64 | 54.93,60.64 P23.1 | U10.6 54.45,64.93 54.93,64.45 54.93,60.64
MOSI
  Top 0.254: P23.4 51.59,59.37 51.59,62.55 52.7,63.66 U10.5
N$1  (via drill 0.35)
  Top 0.508: P4.2 61.19,25.8 v61.59,25.4
  Bottom 0.254: U3.6 57.15,35.74 C3.2 59.37,35.88 60.64,34.61 60.64,28.89 | Q1.3 Q1.2 | Q2.3 59.12,25.4 Q2.2 | Q3.3 59.12,22.23 Q3.2
  Bottom 0.508: v61.59,25.4 61.59,23.5 60.33,22.23 59.12,22.23 | 59.12,25.4 v61.59,25.4 | Q1.3 59.45,28.89 60.64,28.89 61.28,28.89 61.59,28.57 v61.59,25.4
N$2
  Bottom 0.254: U3.5 56.2,35.06 C3.1 54.29,35.88 53.66,35.24 R1.2
N$3
  Bottom 0.254: R6.2 58.24,32.7 56.81,32.7 56.2,32.09 U3.2
N$4
  Top 0.254: U5.3 31.43,8.89 30.8,8.26 30.8,7.3 31.75,6.35 U5.1 33.52,5.28 33.52,4.45 R8.1
N$5
  Bottom 0.254: Q3.4 57.48,21.26 57.15,21.59 57.15,24.45 | 57.15,24.45 57.15,27.94 | 57.15,27.94 U3.1 | Q2.4 59.11,24.45 57.15,24.45 | Q1.4 59.11,27.94 57.15,27.94
N$6  (1 unrouted)
  Top 0.254: C13.1 39.67,69.39 | U7.3 D2.3
N$7
  Bottom 0.254: Q3.5 54.91,21.26 55.25,21.59 55.25,24.45 | 55.25,24.45 55.25,27.94 | 55.25,27.94 U3.3 | Q1.5 55.25,27.94 | Q2.5 53.29,24.45 55.25,24.45
N$8
  Top 0.152: R16.2 41.42,43.18 41.42,43.54 40.8,44.15 U9.3
N$9
  Top 0.152: U9.1 40.64,42.06 C16.1
N$10
  Top 0.152: C18.2 41.71,46.65 U9.8
N$11
  Top 0.152: R16.1 C18.1 | R16.1 44.31,41.91 L2.P$2 | R16.1 41.57,44.65 U9.4 U9.5 U9.6 U9.7
N$12
  Top 0.152: R22.2 36.2,43.12 36.73,43.65 U9.19
N$13
  Top 0.254: U4.2 60.64,74.75 R7.2
N$14
  Top 0.254: C21.1 39.48,49.15 U9.10
N$15
  Top 0.152: R25.1 35.44,44.15 U9.18
N$16
  Top 0.152: C23.1 33.48,41.91 R25.2
N$17
  Top 0.508: U8.3 U8.4 33.06,79.72 L1.P$2
N$18
  Top 0.254: R31.2 R30.1 31.68,44.65 U9.17
N$19
  Top 0.508: J1.1 22.17,21.73 C4.1 24.58,21.59 U2.2 30.18,21.59 31.62,23.03 J2.1
N$20
  Top 0.254: D3.2 58.13,19.4 66.99,28.26 66.99,48.26 57.15,58.1 P23.2 51.28,56.52 50.01,56.52 49.05,57.47 49.05,61.28 50.48,62.71 50.48,65.25 52.7,67.47 U10.8 52.63,67.47 50.54,69.55 43.81,69.55 C17.1 41.72,70.03 U7.2
N$21  (via drill 0.35)
  Top 0.254: R27.2 50.48,75.25 | 50.48,75.25 R26.1 | 50.48,75.25 v50.48,76.2
  Bottom 0.254: 51.08,75.25 P48.D+ 51.35,75.33 v50.48,76.2
N$22  (via drill 0.35)
  Top 0.254: R23.1 50.48,73.66 | 50.48,73.66 R24.2 | 50.48,73.66 v50.48,72.71
  Bottom 0.254: P48.D- 49.35,74.79 50.48,73.66 v50.48,72.71
N$23
  Top 0.254: C12.1 28.24,73.65 U8.11
  Top 0.508: J4.2 38.2,83.12 29.45,83.12 27.93,81.6 L1.P$1 28.1,80.48
  pour Top (no thermals): 30.16,80.01 30.16,75.88 30,75.72 29.53,75.72 29.21,75.41 29.21,74.93 26.83,74.93 26.04,75.72 26.04,80.01 26.99,80.96 29.21,80.96
N$24  (via drill 0.35)
  Top 0.254: R21.2 9.72,2.22 4.6,2.22 2.7,4.13 2.7,17.3 v6.99,21.59 | v6.35,24.13 6.4,24.08 U11.8
  Bottom 0.254: v6.99,21.59 6.35,22.23 v6.35,24.13
N$25
  Top 0.508: 63.18,82.14 U4.5 64.95,82.12 J3.1
N$26
  Top 0.254: C9.1 R8.2 32.2,4.76 R9.1
N$27
  Top 0.254: C5.1 33.52,15.88 33.52,14.41 33.08,13.97 U5.7 31.75,13.97 30.8,13.02 30.8,12.38 31.75,11.43 U5.5
N$28  (via drill 0.35)
  Top 0.254: U1.26 38.27,13.96 v38.42,13.81
  Bottom 0.254: v38.42,13.81 39.83,13.81 R4.1
N$29  (via drill 0.35)
  Top 0.254: U1.25 36.09,15.08 v38.42,15.08
  Bottom 0.254: v38.42,15.08 R5.1
N$30
  Top 0.254: 26.61,7.62 U5.13 27.94,7.62 29.07,6.49 C8.1 R9.2
N$31
  Top 0.254: R11.1 C5.2 32.2,15.56 C7.1
N$32
  Top 0.254: C7.2 R10.2 29.21,15.42 29.21,13.97 27.94,12.7 U5.9
N$33  (1 unrouted)
  Top 0.152: 26.89,51.7 C26.+
  Top 0.254: 26.89,58.7 C28.+ | R30.2 31.43,48.26
  Top 0.508: J6.1 28.89,48.58
  pour Top (no thermals): 37.15,45.4 37.15,46.04 36.51,46.04 35.56,46.99 35.56,49.21 34.92,49.85 29.84,49.85 28.89,50.8 28.89,59.37 28.57,59.69 24.77,59.69 24.77,51.12 28.26,47.62 33.02,47.62 33.66,46.99 33.66,46.04 34.29,45.4
N$34
  Top 0.254: R20.3 18.23,5.84 R20.2 17.66,8.38 14.61,11.43 14.61,15.7 R18.2
N$35  (1 unrouted)
  Top 0.254: 5.95,3.46 3.73,5.68 R19.2 8.89,13.54 R17.2
N$36
  Top 0.254: P3.P$1 R3.1
N$37
  Top 0.152: 6.35,16 R19.1
  Top 0.254: R19.1 7.73,17.46 11.43,17.46 12.38,18.41 U11.17
N$38
  Bottom 0.254: S1.P$3 59.01,8.57 61.07,8.57 S1.P$1 62.58,17.5 K1.C1 64.92,18.27 D1.C
N$39
  Bottom 0.254: R5.2 R4.2 47.01,8.26 54.24,8.26 S1.P$8
N$40
  Top 0.254: R3.2 R2.2 1.14,77.43 1.14,2.86 2.86,1.14 58.72,1.14 S1.P$10
N$41
  Top 0.254: R2.1 6.41,80.9 P3.P$2
N$42
  Top 0.254: R20.1 19.81,16 18.35,17.46 13.15,17.46 12.88,17.73 U11.18
N$45
  Top 0.254: 10.73,18.35 R14.2 | 8.96,18.35 R17.1 R14.2 | R14.2 11.88,19.36 U11.16
N$46
  Top 0.254: R18.1 R15.2 13.38,18.55 U11.19
N$47
  Top 0.254: U11.20 13.88,20.73 14.63,19.98 C29.1
N$48
  Top 0.254: U11.1 8.29,27.58 7.62,28.26 C31.1
N$49
  Top 0.254: U11.2 8.91,26.83 U11.3
  Top 0.508: C31.2 7.3,34.6 | 8.91,26.83 7.62,26.83 6.03,28.42 6.03,33.41 7.23,34.6 C31.2 | C31.2 L3.1
N$50
  Top 0.254: C14.2 10.79,15.06 R14.1
N$51
  Top 0.254: R15.1 13.65,14.11 C15.2
N$52
  Top 0.254: U11.40 11.88,31.62 C32.1
N$53
  Top 0.254: U11.42 11.11,28.56 U11.41
  Top 0.508: 11.11,28.56 11.11,29.69 9.21,31.59 9.21,33.34 10.47,34.6 C32.2 L4.1
N$54
  Top 0.254: U11.33 16.47,27.58 17.14,28.26 C33.1
N$55
  Top 0.254: U11.31 15.86,26.83 U11.32
  Top 0.508: 15.86,26.83 17.14,26.83 18.73,28.42 18.73,33.34 17.46,34.6 C33.2 L5.1
N$56
  Top 0.254: U11.38 12.88,31.62 C34.1
N$57
  Top 0.254: U11.37 13.65,28.56 U11.36
  Top 0.508: 13.65,28.56 13.65,29.69 15.56,31.59 15.56,33.34 14.29,34.6 C34.2 L6.1
N$58
  Top 0.508: L3.2 C35.1 7.62,44.77 5.47,46.92 P58.1
N$59
  Top 0.508: L4.2 C37.2 | C37.2 | P58.2 6.12,55.79 7.3,54.61 7.3,46.99 9.21,45.09 9.21,42.86 10.48,41.59 C37.2
N$60
  Top 0.508: P59.1 14.36,46.92 17.15,44.13 C36.1 L5.2
N$61
  Top 0.508: L6.2 C38.2 14.29,41.59 15.56,42.86 15.56,44.13 12.38,47.31 12.38,54.29 13.88,55.79 P59.2
OP+  (via drill 0.35)
  Top 0.254: U5.4 31.57,10.16 v31.02,9.62
  Bottom 0.254: C6.1 30.12,9.62 v31.02,9.62 31.02,21.82 U6.6
OP-  (via drill 0.35)
  Top 0.254: U5.11 28.12,10.16 v28.67,10.7
  Bottom 0.254: C6.2 29.57,10.7 v28.67,10.7 28.67,24.54 U6.4
OUT_HP
  Top 0.254: SJ2.2 20.5,11.75 18.28,13.97 C15.1
OUT_HP_OP
  Top 0.254: 25.4,13.97 25.08,13.97 24.38,13.27 SJ2.3 24.51,13.27 26.35,11.43 U5.10 | 25.4,13.97 U5.8 | R11.2 26.51,16.21 26.08,16.21 25.4,15.54 25.4,13.97
OUT_LP
  Top 0.254: SJ1.2 22.54,6.67 17.14,12.06 C14.1
OUT_LP_OP
  Top 0.254: U5.14 26.61,6.35 | C9.2 26.65,3.17 25.7,4.13 25.7,5.53 26.51,6.35 U5.14 | 27.94,8.89 U5.12 25.15,8.89 24.45,8.19 | 26.35,6.35 U5.14 | SJ1.3 24.45,8.19 | U5.14 26.29,6.35 24.45,8.19
RST
  Top 0.254: P23.5 49.85,62.71 49.85,66.36 48.74,67.47 U10.1
SCK/VBUS_DETECT
  Top 0.254: R13.2 57.63,66.2 | 57.63,66.2 R12.1 | P23.3 50.96,61.28 50.96,64.61 52.55,66.2 U10.7 57.63,66.2
TP_IND  (via drill 0.35)
  Top 0.254: U4.7 60.64,81.28 60.96,80.96 63.5,80.96 64.14,80.33 v64.14,79.38 | v48.9,66.2 47.18,66.2 U10.2
  Bottom 0.254: v64.14,79.38 64.14,78.42 51.91,66.2 v48.9,66.2
VBUS  (via drill 0.35)  (3 unrouted)
  Top 0.254: R12.2 57.63,72.05 | D2.2 34.64,68.27 35.68,69.3 35.68,71.08 36.65,72.05 57.63,72.05 | 65.06,74.3 63.91,73.14 62.8,73.14 61.7,72.05 57.63,72.05
  Top 0.508: P2.B4/A9 47.9,79.65 48.58,80.33 49.85,80.33 | P2.A4/B9 52.8,79.6 52.07,80.33 50.48,80.33 | 50.48,80.33 50.16,80.33 | 49.85,80.33 50.16,80.33 | 50.16,80.33 50.16,80.64 | 50.16,80.64 50.16,81.28 50.48,81.6 59.05,81.6 59.37,81.92 | 49.85,80.33 50.16,80.64 | 50.48,80.33 50.16,80.64 | U4.8 59.37,80.96 59.93,80.41 59.93,80.25 v60.01,80.17 | U4.PAD2 61.21,79.44 60.79,80.17 v60.01,80.17 | U4.PAD2 61.44,79.38 63.18,77.63 U4.4 63.18,76.52 64.93,74.77 | U4.PAD2 62.07,78.58 v62.55,78.58 | U4.PAD2 60.96,79.38 60.1,80.23 v60.01,80.17
  Bottom 0.508: 60.72,79.3 60.09,79.93 | 60.72,79.3 60.8,79.38 U4.PAD2 61.75,79.38 v62.55,80.17 | 60.72,79.3 v60.01,78.58
  other vias: 61.28,79.38